# Altium project GB-Drone_remote.PrjPcb
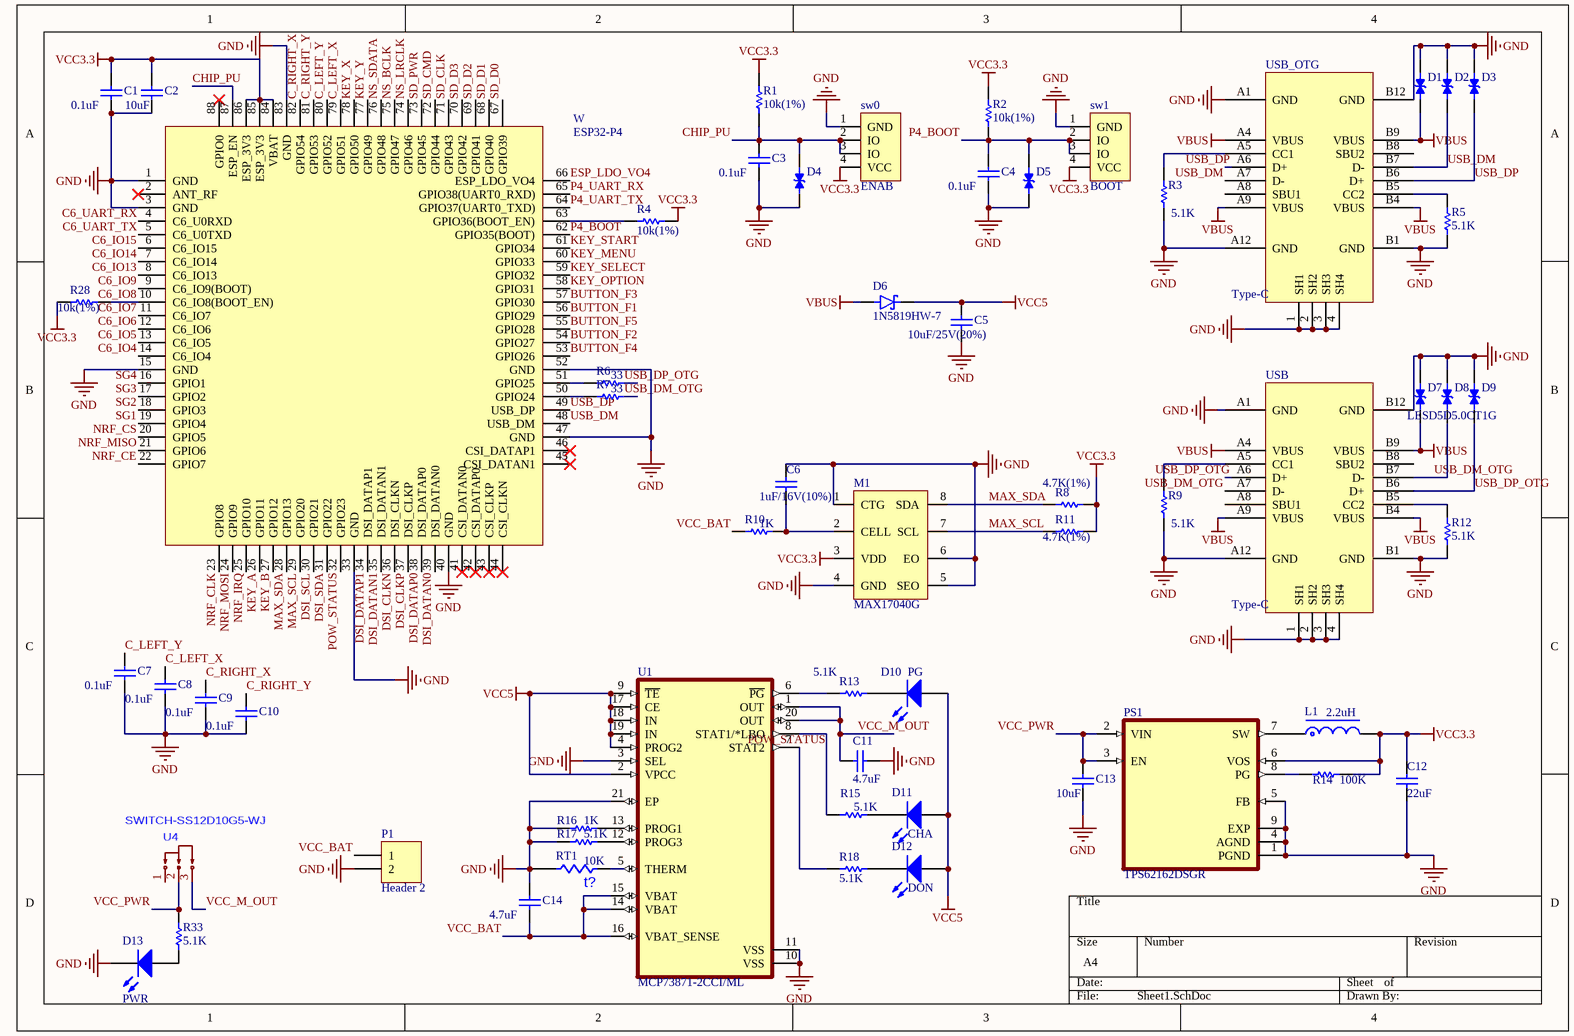
[diagram p0: Sheet1.SchDoc]
2 sheets, 112 parts. Net scope: global (net labels, ports and power ports of the same name join across sheets).
Board file: PCB1.PcbDoc
Sheets:
  Sheet1.SchDoc
  Sheet2.SchDoc

## Sheet Sheet1.SchDoc
size A4; SheetNumber: 1; SheetTotal: 2

### Parts
C1  value 0.1uF  [C0805]  (hidden comment: 0.1uF/50V(10%))
C2  10uF  [C0805]
C3  value 0.1uF  [C0805]  (hidden comment: 0.1uF/50V(10%))
C4  value 0.1uF  [C0805]  (hidden comment: 0.1uF/50V(10%))
C5  10uF/25V(20%)  [C0805]
C6  1uF/16V(10%)  [C0805]
C7  value 0.1uF  [C0805]  (hidden comment: 0.1uF/50V(10%))
C8  value 0.1uF  [C0805]  (hidden comment: 0.1uF/50V(10%))
C9  value 0.1uF  [C0805]  (hidden comment: 0.1uF/50V(10%))
C10  value 0.1uF  [C0805]  (hidden comment: 0.1uF/50V(10%))
C11  4.7uF  [C0805]
C12  22uF  [C0805]
C13  10uF  [C0805]
C14  4.7uF  [C0805]
D1  (no value)  [TVS_LESD5D5.0CT1G]
D2  (no value)  [TVS_LESD5D5.0CT1G]
D3  (no value)  [TVS_LESD5D5.0CT1G]
D4  (no value)  [TVS_LESD5D5.0CT1G]
D5  (no value)  [TVS_LESD5D5.0CT1G]
D6  1N5819HW-7  [SOD3715X145N]
D7  (no value)  [TVS_LESD5D5.0CT1G]
D8  LESD5D5.0CT1G  [TVS_LESD5D5.0CT1G]
D9  (no value)  [TVS_LESD5D5.0CT1G]
D10  PG  [C0805]
D11  CHA  [C0805]
D12  DON  [C0805]
D13  PWR  [C0805]
L1  2.2uH  [INDC6060X300]
M1  MAX17040G  [MAX17040G+T]
P1  Header 2  [XH2.54-2P]
PS1  TPS62162DSGR  [TPS62162DSGR]
R1  10k(1%)  [C0805]
R2  10k(1%)  [C0805]
R3  5.1K  [C0805]
R4  10k(1%)  [C0805]
R5  5.1K  [C0805]
R6  33  [C0805]
R7  33  [C0805]
R8  4.7K(1%)  [C0805]
R9  5.1K  [C0805]
R10  1K  [C0805]
R11  4.7K(1%)  [C0805]
R12  5.1K  [C0805]
R13  5.1K  [C0805]
R14  100K  [C0805]
R15  5.1K  [C0805]
R16  1K  [C0805]
R17  5.1K  [C0805]
R18  5.1K  [C0805]
R28  10k(1%)  [C0805]
R33  5.1K  [C0805]
RT1  10K  [NTC]
sw0  ENAB  [SWITH_Light]
sw1  BOOT  [SWITH_Light]
U1  MCP73871-2CCI/ML  [MCP73871]
U4  SWITCH-SS12D10G5-WJ  [SW-TH_SS12D10G5]
USB  Type-C  [Type-C-TOP]
USB_OTG  Type-C  [Type-C-TOP]
W  ESP32-P4  [ESP32-P4_MODULE]

### Nets
ESP_LDO_VO4: W.66(ESP_LDO_VO4)
GND: C1.1 C2.1 C3.1 C4.1 C5.1 C6.2 C7.1 C8.1 C9.1 C10.1 C11.2 C12.1 C13.1 C14.2 D1.2 D2.2 D3.2 D4.1 D5.1 D7.2 D8.2 D9.2 D13.2(K) M1.1(CTG) M1.4(GND) M1.5(SEO) M1.6(EO) P1.2 PS1.1(PGND) PS1.4(AGND) PS1.5(FB) PS1.9(EXP) R3.1 R5.1 R9.1 R12.1 R16.2 R17.2 RT1.2 sw0.1(GND) sw1.1(GND) U1.3(SEL) U1.10(VSS) U1.11(VSS) U1.21(EP) USB.1(SH1) USB.2(SH2) USB.3(SH3) USB.4(SH4) USB.A1(GND) USB.A12(GND) USB.B1(GND) USB.B12(GND) USB_OTG.1(SH1) USB_OTG.2(SH2) USB_OTG.3(SH3) USB_OTG.4(SH4) USB_OTG.A1(GND) USB_OTG.A12(GND) USB_OTG.B1(GND) USB_OTG.B12(GND) W.1(GND) W.3(GND) W.15(GND) W.33(GND) W.40(GND) W.47(GND) W.52(GND) W.83(GND)
VBUS: D1.1 D6.A D7.1 USB.A4(VBUS) USB.A9(VBUS) USB.B4(VBUS) USB.B9(VBUS) USB_OTG.A4(VBUS) USB_OTG.A9(VBUS) USB_OTG.B4(VBUS) USB_OTG.B9(VBUS)
VCC3.3: C1.2 C2.2 C12.2 L1.2 M1.3(VDD) PS1.6(VOS) R1.2 R2.2 R4.2 R8.2 R11.2 R14.1 R28.2 sw0.4(VCC) sw1.4(VCC) W.84(VBAT) W.85(ESP_3V3) W.86(ESP_3V3)
VCC5: C5.2 D6.C(K) D10.1(A) D11.1(A) D12.1(A) U1.2(VPCC) U1.4(PROG2) U1.9(~{TE}) U1.17(CE) U1.18(IN) U1.19(IN)
BUTTON_F1: W.56(GPIO29)
BUTTON_F2: W.54(GPIO27)
BUTTON_F3: W.57(GPIO30)
BUTTON_F4: W.53(GPIO26)
BUTTON_F5: W.55(GPIO28)
C6_IO4: W.14(C6_IO4)
C6_IO5: W.13(C6_IO5)
C6_IO6: W.12(C6_IO6)
C6_IO7: W.11(C6_IO7)
C6_IO8: R28.1 W.10(C6_IO8(BOOT_EN))
C6_IO9: W.9(C6_IO9(BOOT))
C6_IO13: W.8(C6_IO13)
C6_IO14: W.7(C6_IO14)
C6_IO15: W.6(C6_IO15)
C6_UART_RX: W.4(C6_U0RXD)
C6_UART_TX: W.5(C6_U0TXD)
C_LEFT_X: C8.2 W.79(GPIO51)
C_LEFT_Y: C7.2 W.80(GPIO52)
C_RIGHT_X: C9.2 W.82(GPIO54)
C_RIGHT_Y: C10.2 W.81(GPIO53)
CHIP_PU: C3.2 D4.2 R1.1 sw0.2(IO) sw0.3(IO) W.87(ESP_EN)
DSI_CLKN: W.36(DSI_CLKN)
DSI_CLKP: W.37(DSI_CLKP)
DSI_DATAN0: W.39(DSI_DATAN0)
DSI_DATAN1: W.35(DSI_DATAN1)
DSI_DATAP0: W.38(DSI_DATAP0)
DSI_DATAP1: W.34(DSI_DATAP1)
DSI_SCL: W.30(GPIO21)
DSI_SDA: W.31(GPIO22)
KEY_A: W.26(GPIO11)
KEY_B: W.27(GPIO12)
KEY_MENU: W.60(GPIO33)
KEY_OPTION: W.58(GPIO31)
KEY_SELECT: W.59(GPIO32)
KEY_START: W.61(GPIO34)
KEY_X: W.78(GPIO50)
KEY_Y: W.77(GPIO49)
MAX_SCL: M1.7(SCL) R11.1 W.29(GPIO20)
MAX_SDA: M1.8(SDA) R8.1 W.28(GPIO13)
NRF_CE: W.22(GPIO7)
NRF_CLK: W.23(GPIO8)
NRF_CS: W.20(GPIO5)
NRF_IRQ: W.25(GPIO10)
NRF_MISO: W.21(GPIO6)
NRF_MOSI: W.24(GPIO9)
NS_BCLK: W.75(GPIO47)
NS_LRCLK: W.74(GPIO46)
NS_SDATA: W.76(GPIO48)
P4_BOOT: C4.2 D5.2 R2.1 sw1.2(IO) sw1.3(IO) W.62(GPIO35(BOOT))
P4_UART_RX: W.65(GPIO38(UART0_RXD))
P4_UART_TX: W.64(GPIO37(UART0_TXD))
POW_STATUS: R15.2 U1.8(STAT1/*LBO) W.32(GPIO23)
SD_CLK: W.71(GPIO43)
SD_CMD: W.72(GPIO44)
SD_D0: W.67(GPIO39)
SD_D1: W.68(GPIO40)
SD_D2: W.69(GPIO41)
SD_D3: W.70(GPIO42)
SD_PWR: W.73(GPIO45)
SG1: W.19(GPIO4)
SG2: W.18(GPIO3)
SG3: W.17(GPIO2)
SG4: W.16(GPIO1)
USB_DM: D2.1 USB_OTG.A7(D-) USB_OTG.B7(D-) W.48(USB_DM)
USB_DM_OTG: D8.1 R7.1 USB.A7(D-) USB.B7(D-)
USB_DP: D3.1 USB_OTG.A6(D+) USB_OTG.B6(D+) W.49(USB_DP)
USB_DP_OTG: D9.1 R6.1 USB.A6(D+) USB.B6(D+)
VCC_BAT: C14.1 P1.1 R10.1 U1.14(VBAT) U1.15(VBAT) U1.16(VBAT_SENSE)
VCC_M_OUT: C11.1 U1.1(OUT) U1.20(OUT) U4.3
VCC_PWR: C13.2 PS1.2(VIN) PS1.3(EN) R33.1 U4.2
NetC6_1: C6.1 M1.2(CELL) R10.2
NetD10_2: D10.2(K) R13.1
NetD11_2: D11.2(K) R15.1
NetD12_2: D12.2(K) R18.1
NetD13_1: D13.1(A) R33.2
NetL1_1: L1.1 PS1.7(SW)
NetPS1_8: PS1.8(PG) R14.2
NetR3_2: R3.2 USB_OTG.A5(CC1)
NetR4_1: R4.1 W.63(GPIO36(BOOT_EN))
NetR5_2: R5.2 USB_OTG.B5(CC2)
NetR6_2: R6.2 W.51(GPIO25)
NetR7_2: R7.2 W.50(GPIO24)
NetR9_2: R9.2 USB.A5(CC1)
NetR12_2: R12.2 USB.B5(CC2)
NetR13_2: R13.2 U1.6(~{PG})
NetR16_1: R16.1 U1.13(PROG1)
NetR17_1: R17.1 U1.12(PROG3)
NetR18_2: R18.2 U1.7(STAT2)
NetRT1_1: RT1.1 U1.5(THERM)

Not connected (* = marked no-connect by the designer): U4 1; USB A8(SBU1) B8(SBU2); USB_OTG A8(SBU1) B8(SBU2); W 2(ANT_RF)* 41(CSI_DATAN0)* 42(CSI_DATAP0)* 43(CSI_CLKP)* 44(CSI_CLKN)* 45(CSI_DATAN1)* 46(CSI_DATAP1)* 88(GPIO0)*

### Notes on the sheet
- (in symbol Res Thermal) t?

### Library data of the parts
C1-C14 = Cap: Capacitor; Published: 8-Jun-2000; LatestRevisionDate: 17-Jul-2002; LatestRevisionNote: Re-released for DXP Platform.; PackageReference: RAD-0.3; Publisher: Altium Limited; PackageDescription: Radial Cap, Thru-Hole; 2 Leads; 0.3 in Pin Spacing
D1-D5 D7-D9 = LESD5D5.0CT1G: Transient Voltage Suppressors for ESD Protection; MF: Leshan Radio Co.; Check_prices: https://www.snapeda.com/parts/LESD5D5.0CT1G/Leshan+Radio+Co./view-part/?ref=eda; Value: *; Availability: Not in stock; Package: None; SnapEDA_Link: https://www.snapeda.com/parts/LESD5D5.0CT1G/Leshan+Radio+Co./view-part/?ref=snap; MP: LESD5D5.0CT1G; Price: None
D6 = 1N5819HW-7: Diode Schottky 40 V 1A Surface Mount SOD-123; MF: Diodes Inc.; SnapEDA_Link: https://www.snapeda.com/parts/1N5819HW-7/Diodes+Inc./view-part/?ref=snap; Price: None; Check_prices: https://www.snapeda.com/parts/1N5819HW-7/Diodes+Inc./view-part/?ref=eda; Availability: In Stock; Value: *; MP: 1N5819HW-7; Package: SOD-123 Fairchild Semiconductor; Purchase-URL: https://pricing.snapeda.com/search/part/1N5819HW-7/?ref=eda
D10-D13 = LED0: Typical INFRARED GaAs LED; Published: 8-Jun-2000; LatestRevisionDate: 08-Jul-2005; LatestRevisionNote: Mech Layer 1 removed.; PackageReference: LED-0; Publisher: Altium Limited; PackageDescription: LED; 2 Leads
L1 = L-NR: NR功率电感; 版权归属: 源创客; BOM名称: NR功率电感; 学习资源: www.ooocke.com
M1 = MAX17040G: 电量检测
P1 = Header 2: Header, 2-Pin; LatestRevisionDate: 17-Jul-2002; LatestRevisionNote: Re-released for DXP Platform.; Publisher: Altium Limited
PS1 = TPS62162DSGR: 3V-17V 1A Step-Down Converters with DCS-Controlâ„¢; MF: Texas Instruments; SnapEDA_Link: https://www.snapeda.com/parts/TPS62162DSGR/Texas+Instruments/view-part/?ref=snap; Package: WSON-8 Texas Instruments; Value: *; MP: TPS62162DSGR; Check_prices: https://www.snapeda.com/parts/TPS62162DSGR/Texas+Instruments/view-part/?ref=eda
R1-R18 R28 R33 = Res1: Resistor; Published: 8-Jun-2000; LatestRevisionDate: 17-Jul-2002; LatestRevisionNote: Re-released for DXP Platform.; PackageReference: AXIAL-0.3; Publisher: Altium Limited; PackageDescription: Axial Device, Thru-Hole; 2 Leads; 0.3 in Pin Spacing
RT1 = Res Thermal: Published: 24-Mar-1999; LatestRevisionDate: 29-May-2009; LatestRevisionNote: IPC-7351 Footprint Added.; PackageVersion: Mar-2003; PackageReference: 6-0805; Publisher: Altium Limited; PackageDescription: Chip Resistor 0805 Case Size; Code_IPC: RESC2012
sw0 sw1 = SWITCH_LIGHT
U1 = MCP73871-2CCI/ML: Charger IC Lithium Ion/Polymer 20-QFN (4x4); MF: Microchip Technology; Package: QFN-20 Microchip; Price: None; Check_prices: https://www.snapeda.com/parts/MCP73871-2CCI/ML/Microchip/view-part/?ref=eda; Value: *; SnapEDA_Link: https://www.snapeda.com/parts/MCP73871-2CCI/ML/Microchip/view-part/?ref=snap; MP: MCP73871-2CCI/ML; Availability: In Stock; Purchase-URL: https://pricing.snapeda.com/search/part/MCP73871-2CCI/ML/?ref=eda
USB USB_OTG = USB-Type-C-TOP
W = ESP32-P4-Module: ESP32P4+ESP32C6; ComponentLink1Description: 供应商链接; ComponentLink1URL: http://www.szlcsc.com/product/details_24852.html; Package: QFN-24_4x4x05P; Supplier: LC; SuppliersPartNumber: C24112

## Sheet Sheet2.SchDoc
size A4; SheetNumber: 2; SheetTotal: 2
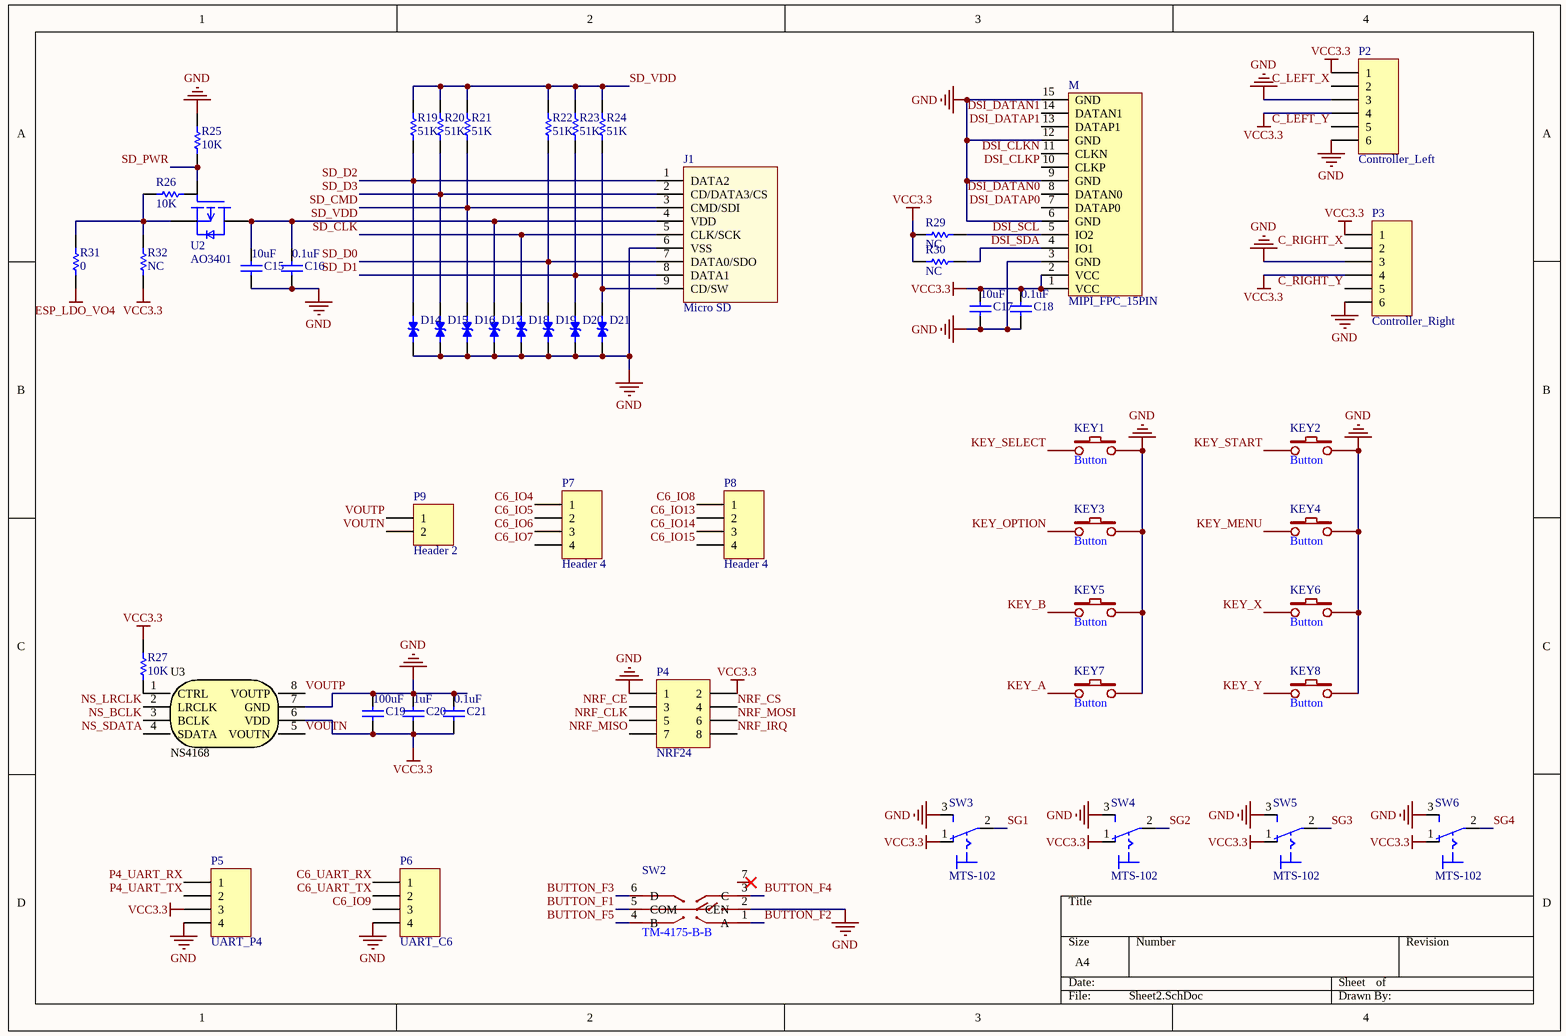
[diagram p1: Sheet2.SchDoc]

### Parts
C15  value 10uF  [C0805]  (hidden comment: 10uF/25v(20%))
C16  value 0.1uF  [C0805]  (hidden comment: 0.1uF/50V(10%))
C17  value 10uF  [C0805]  (hidden comment: 10uF/25v(20%))
C18  value 0.1uF  [C0805]  (hidden comment: 0.1uF/50V(10%))
C19  100uF  [C1206]
C20  1uF  [C0805]
C21  value 0.1uF  [C0805]  (hidden comment: 0.1uF/50V(10%))
D14  (no value)  [TVS_LESD5D5.0CT1G]
D15  (no value)  [TVS_LESD5D5.0CT1G]
D16  (no value)  [TVS_LESD5D5.0CT1G]
D17  (no value)  [TVS_LESD5D5.0CT1G]
D18  (no value)  [TVS_LESD5D5.0CT1G]
D19  (no value)  [TVS_LESD5D5.0CT1G]
D20  (no value)  [TVS_LESD5D5.0CT1G]
D21  (no value)  [TVS_LESD5D5.0CT1G]
J1  Micro SD  [Micro SD]
KEY1  Button  [SWITCH-A6]
KEY2  Button  [SWITCH-A6]
KEY3  Button  [SWITCH-A6]
KEY4  Button  [SWITCH-A6]
KEY5  Button  [SWITCH-A6]
KEY6  Button  [SWITCH-A6]
KEY7  Button  [SWITCH-A6]
KEY8  Button  [SWITCH-A6]
M  MIPI_FPC_15PIN  [FPC-SMD_15P-P1.00_HDGC_1.0K-GT-15PB]
P2  Controller_Left  [PH2.0-6P - SMT]
P3  Controller_Right  [PH2.0-6P - SMT]
P4  NRF24  [NRF24]
P5  UART_P4  [HDR1X4]
P6  UART_C6  [HDR1X4]
P7  Header 4  [HDR1X4]
P8  Header 4  [HDR1X4]
P9  Header 2  [XH2.54-2P]
R19  51K  [C0805]
R20  51K  [C0805]
R21  51K  [C0805]
R22  51K  [C0805]
R23  51K  [C0805]
R24  51K  [C0805]
R25  10K  [C0805]
R26  10K  [C0805]
R27  10K  [C0805]
R29  NC  [C0805]
R30  NC  [C0805]
R31  0  [C0805]
R32  NC  [C0805]
SW2  TM-4175-B-B  [TM4175-B-B]
SW3  MTS-102  [MTS-102]
SW4  MTS-102  [MTS-102]
SW5  MTS-102  [MTS-102]
SW6  MTS-102  [MTS-102]
U2  AO3401  [A03401]
U3  NS4168  [NS4168]

### Nets
ESP_LDO_VO4: R31.2
GND: C15.1 C16.1 C17.1 C18.1 C19.2 C20.2 C21.2 D14.1 D15.1 D16.1 D17.1 D18.1 D19.1 D20.1 D21.1 J1.6(VSS) KEY1.2 KEY2.2 KEY3.2 KEY4.2 KEY5.2 KEY6.2 KEY7.2 KEY8.2 M.3(GND) M.6(GND) M.9(GND) M.12(GND) M.15(GND) P2.3 P2.6 P3.3 P3.6 P4.1 P5.4 P6.4 R25.1 SW2.2(CEN) SW3.3(S) SW4.3(S) SW5.3(S) SW6.3(S) U3.7(GND)
VCC3.3: C17.2 C18.2 C19.1 C20.1 C21.1 M.1(VCC) M.2(VCC) P2.1 P2.4 P3.1 P3.4 P4.2 P5.3 R27.1 R29.2 R30.2 R32.2 SW3.1(O) SW4.1(O) SW5.1(O) SW6.1(O) U3.6(VDD)
BUTTON_F1: SW2.5(COM)
BUTTON_F2: SW2.1(A)
BUTTON_F3: SW2.6(D)
BUTTON_F4: SW2.3(C)
BUTTON_F5: SW2.4(B)
C6_IO4: P7.1
C6_IO5: P7.2
C6_IO6: P7.3
C6_IO7: P7.4
C6_IO8: P8.1
C6_IO9: P6.3
C6_IO13: P8.2
C6_IO14: P8.3
C6_IO15: P8.4
C6_UART_RX: P6.1
C6_UART_TX: P6.2
C_LEFT_X: P2.2
C_LEFT_Y: P2.5
C_RIGHT_X: P3.2
C_RIGHT_Y: P3.5
DSI_CLKN: M.11(CLKN)
DSI_CLKP: M.10(CLKP)
DSI_DATAN0: M.8(DATAN0)
DSI_DATAN1: M.14(DATAN1)
DSI_DATAP0: M.7(DATAP0)
DSI_DATAP1: M.13(DATAP1)
DSI_SCL: M.5(IO2) R29.1
DSI_SDA: M.4(IO1) R30.1
KEY_A: KEY7.1
KEY_B: KEY5.1
KEY_MENU: KEY4.1
KEY_OPTION: KEY3.1
KEY_SELECT: KEY1.1
KEY_START: KEY2.1
KEY_X: KEY6.1
KEY_Y: KEY8.1
NRF_CE: P4.3
NRF_CLK: P4.5
NRF_CS: P4.4
NRF_IRQ: P4.8
NRF_MISO: P4.7
NRF_MOSI: P4.6
NS_BCLK: U3.3(BCLK)
NS_LRCLK: U3.2(LRCLK)
NS_SDATA: U3.4(SDATA)
P4_UART_RX: P5.1
P4_UART_TX: P5.2
SD_CLK: D18.2 J1.5(CLK/SCK)
SD_CMD: D16.2 J1.3(CMD/SDI) R21.2
SD_D0: D19.2 J1.7(DATA0/SDO) R22.2
SD_D1: D20.2 J1.8(DATA1) R23.2
SD_D2: D14.2 J1.1(DATA2) R19.2
SD_D3: D15.2 J1.2(CD/DATA3/CS) R20.2
SD_PWR: R25.2 U2.1(G)
SD_VDD: C15.2 C16.2 D17.2 J1.4(VDD) R19.1 R20.1 R21.1 R22.1 R23.1 R24.1 U2.3(D)
SG1: SW3.2(P)
SG2: SW4.2(P)
SG3: SW5.2(P)
SG4: SW6.2(P)
VOUTN: P9.2 U3.5(VOUTN)
VOUTP: P9.1 U3.8(VOUTP)
NetD21_2: D21.2 J1.9(CD/SW) R24.2
NetR26_1: R26.1 R31.1 R32.1 U2.2(S)
NetR27_2: R27.2 U3.1(CTRL)

Not connected (* = marked no-connect by the designer): R26 2; SW2 7*

### Library data of the parts
C15-C21 = Cap: Capacitor; Published: 8-Jun-2000; LatestRevisionDate: 17-Jul-2002; LatestRevisionNote: Re-released for DXP Platform.; PackageReference: RAD-0.3; Publisher: Altium Limited; PackageDescription: Radial Cap, Thru-Hole; 2 Leads; 0.3 in Pin Spacing
  C19: Value: 100uF
  C20: Value: 1uF
D14-D21 = LESD5D5.0CT1G: as D1 on sheet Sheet1; Check_prices: https://www.snapeda.com/parts/LESD5D5.0CT1G/Leshan+Radio+Co./view-part/?ref=eda; Value: *; Availability: Not in stock; Package: None; SnapEDA_Link: https://www.snapeda.com/parts/LESD5D5.0CT1G/Leshan+Radio+Co./view-part/?ref=snap; MP: LESD5D5.0CT1G; Price: None
J1 = Micro SD: Micro SD卡; 版权归属: 源创客; BOM名称: Micro SD卡; 学习资源: www.ooocke.com
KEY1-KEY8 = Button: A6按键; Manufacturer: 韩国韩荣; Symbol: K2-1817UQ-C4SW-01; Add into BOM: yes; Contact Current: 50mA; Voltage Rating (DC): 12V; Insulation Resistance: 100MΩ; Circuit: 单刀单掷; Actuator Style: 圆形按钮; Operating Force: 250gf@±30gf; Mechanical Life: 100000; Switch Length: 6mm; Switch Height: 5mm; Device: K2-1817UQ-C4SW-01; LCSC Part Name: 无声开关 6.0mm*6.0mm*5mm  250G; Supplier Part: C128939; Manufacturer Part: K2-1817UQ-C4SW-01; Supplier Footprint: SMD; JLCPCB Part Class: 扩展库; Datasheet: https://atta.szlcsc.com/upload/public/pdf/source/20210322/C2690010_58F7DD7E136B4BFA712F0D44F3FEADD9.pdf; Supplier: LCSC; Convert to PCB: yes; Mounting Style: 立贴; With Lamp: -; Operating Temperature: -25℃~+85℃; Switch Width: 6mm
M = MIPI_FPC_15PIN: 立式
P2 P3 = Header 6: Header, 6-Pin; LatestRevisionDate: 17-Jul-2002; LatestRevisionNote: Re-released for DXP Platform.; Publisher: Altium Limited
P4 = Header 4X2: Header, 4-Pin, Dual row; LatestRevisionDate: 17-Jul-2002; LatestRevisionNote: Re-released for DXP Platform.; Publisher: Altium Limited
P5-P8 = Header 4: Header, 4-Pin; LatestRevisionDate: 17-Jul-2002; LatestRevisionNote: Re-released for DXP Platform.; Publisher: Altium Limited
P9 = Header 2: Header, 2-Pin; LatestRevisionDate: 17-Jul-2002; LatestRevisionNote: Re-released for DXP Platform.; Publisher: Altium Limited
R19-R27 R29-R32 = Res1: Resistor; Published: 8-Jun-2000; LatestRevisionDate: 17-Jul-2002; LatestRevisionNote: Re-released for DXP Platform.; PackageReference: AXIAL-0.3; Publisher: Altium Limited; PackageDescription: Axial Device, Thru-Hole; 2 Leads; 0.3 in Pin Spacing
SW2 = TM-4175-B-B: Manufacturer: XKB Connectivity(中国星坤); Add into BOM: yes; Symbol: TM-4175-B-B; Device: TM-4175-B-B; Supplier: LCSC; Supplier Part: C465996; Manufacturer Part: TM-4175-B-B; JLCPCB Part Class: 扩展库; LCSC Part Name: 7.5*7.5*6五向开关 H6 升级减少摇晃 显示器五向开关; Supplier Footprint: SMD-8P,7.5x7.5mm; Datasheet: https://atta.szlcsc.com/upload/public/pdf/source/20211011/A0F6117F2AB0E02F6CF3847B7456F266.pdf; Convert to PCB: yes
SW3-SW6 = MTS-102: Rectangular Cable Assemblies .100 Mini Mate Single Row Discrete Wire Cable Assembly, Terminal; MF: Motorola; MP: MTS102; Availability: Unavailable; Value: *; Package: None; SnapEDA_Link: https://www.snapeda.com/parts/MTS102/Motorola/view-part/698799/?ref=snap; Price: None; Check_prices: https://www.snapeda.com/parts/MTS102/Motorola/view-part/698799/?ref=eda
U2 = AO3401: P-Channel 30 V 4A (Ta) 1.4W (Ta) Surface Mount SOT-23-3; MF: Alpha & Omega Semiconductor; SnapEDA_Link: https://www.snapeda.com/parts/AO3401/Alpha/view-part/?ref=snap; Package: SOT-23-3 Alpha &amp; Omega Semiconductor; Value: *; MP: AO3401; Check_prices: https://www.snapeda.com/parts/AO3401/Alpha/view-part/?ref=eda
U3 = NS4168: Add into BOM: yes; Symbol: NS4168; Device: NS4168; Convert to PCB: yes

## Nets that join several sheets
ESP_LDO_VO4: Sheet1 (W.66), Sheet2 (R31.2)
GND: Sheet1 (69 pins), Sheet2 (43 pins)
VCC3.3: Sheet1 (18 pins), Sheet2 (22 pins)
BUTTON_F1: Sheet1 (W.56), Sheet2 (SW2.5)
BUTTON_F2: Sheet1 (W.54), Sheet2 (SW2.1)
BUTTON_F3: Sheet1 (W.57), Sheet2 (SW2.6)
BUTTON_F4: Sheet1 (W.53), Sheet2 (SW2.3)
BUTTON_F5: Sheet1 (W.55), Sheet2 (SW2.4)
C6_IO4: Sheet1 (W.14), Sheet2 (P7.1)
C6_IO5: Sheet1 (W.13), Sheet2 (P7.2)
C6_IO6: Sheet1 (W.12), Sheet2 (P7.3)
C6_IO7: Sheet1 (W.11), Sheet2 (P7.4)
C6_IO8: Sheet1 (R28.1 W.10), Sheet2 (P8.1)
C6_IO9: Sheet1 (W.9), Sheet2 (P6.3)
C6_IO13: Sheet1 (W.8), Sheet2 (P8.2)
C6_IO14: Sheet1 (W.7), Sheet2 (P8.3)
C6_IO15: Sheet1 (W.6), Sheet2 (P8.4)
C6_UART_RX: Sheet1 (W.4), Sheet2 (P6.1)
C6_UART_TX: Sheet1 (W.5), Sheet2 (P6.2)
C_LEFT_X: Sheet1 (C8.2 W.79), Sheet2 (P2.2)
C_LEFT_Y: Sheet1 (C7.2 W.80), Sheet2 (P2.5)
C_RIGHT_X: Sheet1 (C9.2 W.82), Sheet2 (P3.2)
C_RIGHT_Y: Sheet1 (C10.2 W.81), Sheet2 (P3.5)
DSI_CLKN: Sheet1 (W.36), Sheet2 (M.11)
DSI_CLKP: Sheet1 (W.37), Sheet2 (M.10)
DSI_DATAN0: Sheet1 (W.39), Sheet2 (M.8)
DSI_DATAN1: Sheet1 (W.35), Sheet2 (M.14)
DSI_DATAP0: Sheet1 (W.38), Sheet2 (M.7)
DSI_DATAP1: Sheet1 (W.34), Sheet2 (M.13)
DSI_SCL: Sheet1 (W.30), Sheet2 (M.5 R29.1)
DSI_SDA: Sheet1 (W.31), Sheet2 (M.4 R30.1)
KEY_A: Sheet1 (W.26), Sheet2 (KEY7.1)
KEY_B: Sheet1 (W.27), Sheet2 (KEY5.1)
KEY_MENU: Sheet1 (W.60), Sheet2 (KEY4.1)
KEY_OPTION: Sheet1 (W.58), Sheet2 (KEY3.1)
KEY_SELECT: Sheet1 (W.59), Sheet2 (KEY1.1)
KEY_START: Sheet1 (W.61), Sheet2 (KEY2.1)
KEY_X: Sheet1 (W.78), Sheet2 (KEY6.1)
KEY_Y: Sheet1 (W.77), Sheet2 (KEY8.1)
NRF_CE: Sheet1 (W.22), Sheet2 (P4.3)
NRF_CLK: Sheet1 (W.23), Sheet2 (P4.5)
NRF_CS: Sheet1 (W.20), Sheet2 (P4.4)
NRF_IRQ: Sheet1 (W.25), Sheet2 (P4.8)
NRF_MISO: Sheet1 (W.21), Sheet2 (P4.7)
NRF_MOSI: Sheet1 (W.24), Sheet2 (P4.6)
NS_BCLK: Sheet1 (W.75), Sheet2 (U3.3)
NS_LRCLK: Sheet1 (W.74), Sheet2 (U3.2)
NS_SDATA: Sheet1 (W.76), Sheet2 (U3.4)
P4_UART_RX: Sheet1 (W.65), Sheet2 (P5.1)
P4_UART_TX: Sheet1 (W.64), Sheet2 (P5.2)
SD_CLK: Sheet1 (W.71), Sheet2 (D18.2 J1.5)
SD_CMD: Sheet1 (W.72), Sheet2 (D16.2 J1.3 R21.2)
SD_D0: Sheet1 (W.67), Sheet2 (D19.2 J1.7 R22.2)
SD_D1: Sheet1 (W.68), Sheet2 (D20.2 J1.8 R23.2)
SD_D2: Sheet1 (W.69), Sheet2 (D14.2 J1.1 R19.2)
SD_D3: Sheet1 (W.70), Sheet2 (D15.2 J1.2 R20.2)
SD_PWR: Sheet1 (W.73), Sheet2 (R25.2 U2.1)
SG1: Sheet1 (W.19), Sheet2 (SW3.2)
SG2: Sheet1 (W.18), Sheet2 (SW4.2)
SG3: Sheet1 (W.17), Sheet2 (SW5.2)
SG4: Sheet1 (W.16), Sheet2 (SW6.2)